# EAGLE design DoorModule_V1.0 (EAGLE 7.1.0)
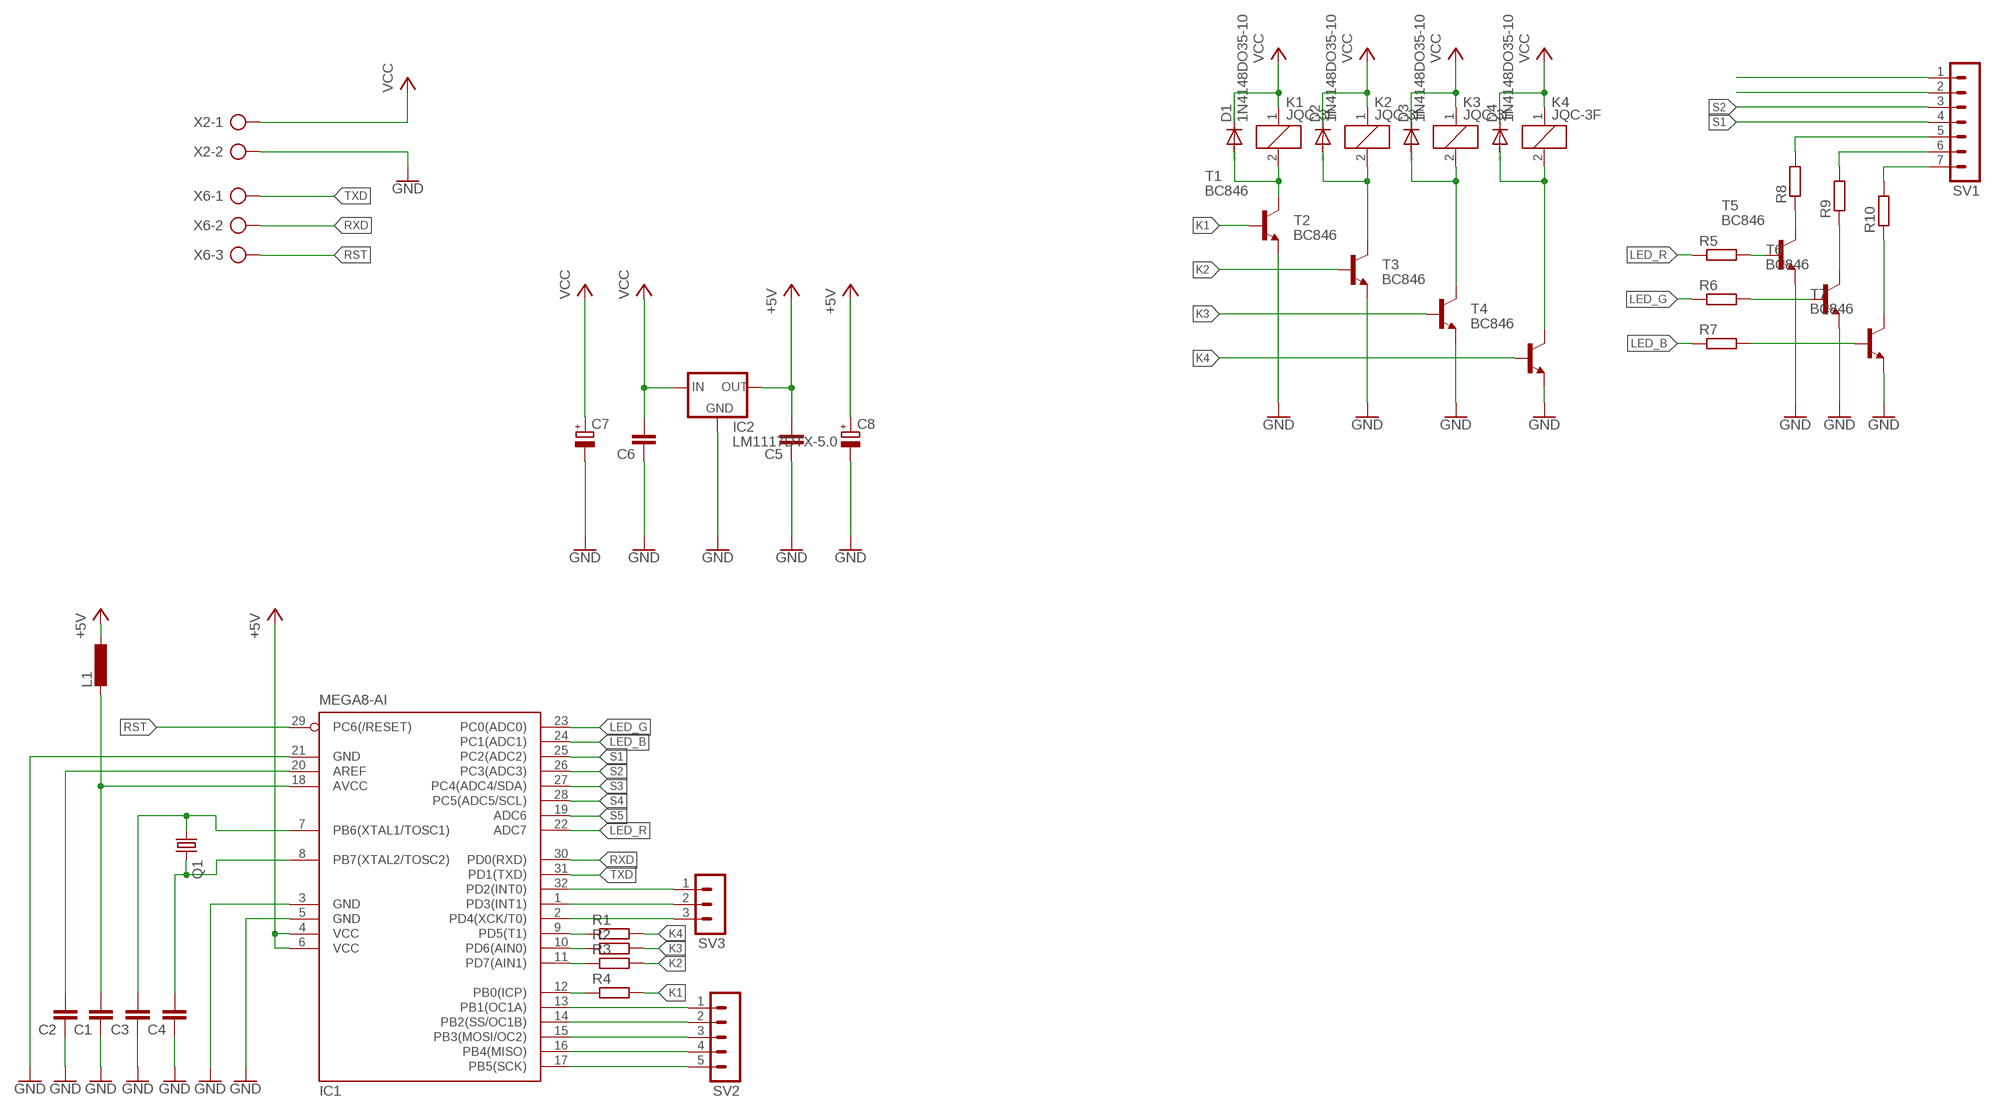
[diagram p0: schematic, sheet 1, part 1 of 2]
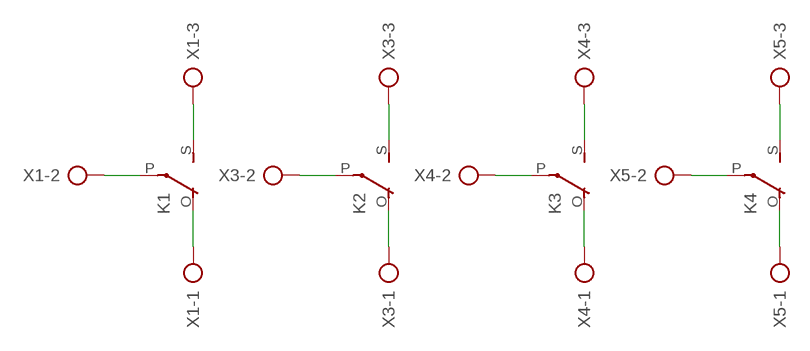
[diagram p1: schematic, sheet 1, part 2 of 2]

## Parts
C1  C-EUC0805  [C0805]
C2  C-EUC0805  [C0805]
C3  C-EUC0805  [C0805]
C4  C-EUC0805  [C0805]
C5  C-EUC0805  [C0805]
C6  C-EUC0805  [C0805]
C7  CPOL-EUE2.5-7  [E2,5-7]
C8  CPOL-EUE2.5-7  [E2,5-7]
D1  1N4148DO35-10  [DO35-10]
D2  1N4148DO35-10  [DO35-10]
D3  1N4148DO35-10  [DO35-10]
D4  1N4148DO35-10  [DO35-10]
IC1  MEGA8-AI  [TQFP32-08]
IC2  LM1117DTX-5.0  [TO252]
K1  JQC-3F  G5LE  [G5LE]
K2  JQC-3F  G5LE  [G5LE]
K3  JQC-3F  G5LE  [G5LE]
K4  JQC-3F  G5LE  [G5LE]
L1  L-EU0204/7  [0204/7]
Q1  CRYSTALHC49U-V  [HC49U-V]
R1  R-EU_0204/7  [0204/7]
R2  R-EU_0204/7  [0204/7]
R3  R-EU_0204/7  [0204/7]
R4  R-EU_0204/7  [0204/7]
R5  R-EU_R0805  [R0805]
R6  R-EU_R0805  [R0805]
R7  R-EU_R0805  [R0805]
R8  R-EU_0204/7  [0204/7]
R9  R-EU_0204/7  [0204/7]
R10  R-EU_0204/7  [0204/7]
SV1  MA07-1  [MA07-1]
SV2  MA05-1  [MA05-1]
SV3  MA03-1  [MA03-1]
T1  BC846  [SOT23]
T2  BC846  [SOT23]
T3  BC846  [SOT23]
T4  BC846  [SOT23]
T5  BC846  [SOT23]
T6  BC846  [SOT23]
T7  BC846  [SOT23]
X1  AK300/3  [AK300/3]
X2  AK300/2  [AK300/2]
X3  AK300/3  [AK300/3]
X4  AK300/3  [AK300/3]
X5  AK300/3  [AK300/3]
X6  AK300/3  [AK300/3]

## Nets
+5V: C5.2 C8.+ IC1.4(VCC) IC1.6(VCC) IC2.TAB(OUT) L1.1
GND: C1.1 C2.1 C3.1 C4.1 C5.1 C6.1 C7.- C8.- IC1.3(GND) IC1.5(GND) IC1.21(GND) IC2.1(GND) T1.2(E) T2.2(E) T3.2(E) T4.2(E) T5.2(E) T6.2(E) T7.2(E) X2.2
K1: R4.2 T1.1(B)
K2: R3.2 T2.1(B)
K3: R2.2 T3.1(B)
K4: R1.2 T4.1(B)
LED_B: IC1.24(PC1(ADC1)) R7.1
LED_G: IC1.23(PC0(ADC0)) R6.1
LED_R: IC1.22(ADC7) R5.1
N$1: K1.S(2:S) X1.3
N$2: K1.O(2:O) X1.1
N$3: K1.P(2:P) X1.2
N$4: K2.S(2:S) X3.3
N$5: C1.2 IC1.18(AVCC) L1.2
N$6: C2.2 IC1.20(AREF)
N$7: C3.2 IC1.7(PB6(XTAL1/TOSC1)) Q1.1
N$8: C4.2 IC1.8(PB7(XTAL2/TOSC2)) Q1.2
N$9: IC1.13(PB1(OC1A)) SV2.1
N$10: IC1.14(PB2(SS/OC1B)) SV2.2
N$11: D1.A K1.2 T1.3(C)
N$12: D2.A K2.2 T2.3(C)
N$13: R5.2 T5.1(B)
N$14: R6.2 T6.1(B)
N$15: R7.2 T7.1(B)
N$16: R8.1 T5.3(C)
N$17: R9.1 T6.3(C)
N$18: R10.1 T7.3(C)
N$19: R9.2 SV1.6
N$20: R10.2 SV1.7
N$21: D3.A K3.2 T3.3(C)
N$22: D4.A K4.2 T4.3(C)
N$23: IC1.9(PD5(T1)) R1.1
N$24: IC1.10(PD6(AIN0)) R2.1
N$25: IC1.11(PD7(AIN1)) R3.1
N$26: IC1.12(PB0(ICP)) R4.1
N$27: IC1.15(PB3(MOSI/OC2)) SV2.3
N$28: IC1.16(PB4(MISO)) SV2.4
N$29: IC1.32(PD2(INT0)) SV3.1
N$30: R8.2 SV1.5
N$31: K2.P(2:P) X3.2
N$32: K2.O(2:O) X3.1
N$33: K3.P(2:P) X4.2
N$34: K3.S(2:S) X4.3
N$35: K3.O(2:O) X4.1
N$36: K4.S(2:S) X5.3
N$37: K4.P(2:P) X5.2
N$38: K4.O(2:O) X5.1
N$39: IC1.17(PB5(SCK)) SV2.5
N$40: IC1.1(PD3(INT1)) SV3.2
N$41: IC1.2(PD4(XCK/T0)) SV3.3
RST: IC1.29(PC6(/RESET)) X6.3
RXD: IC1.30(PD0(RXD)) X6.2
S1: IC1.25(PC2(ADC2)) SV1.4
S2: IC1.26(PC3(ADC3)) SV1.3
S3: IC1.27(PC4(ADC4/SDA)) SV1.2
S4: IC1.28(PC5(ADC5/SCL)) SV1.1
S5: IC1.19(ADC6)
TXD: IC1.31(PD1(TXD)) X6.1
VCC: C6.2 C7.+ D1.C D2.C D3.C D4.C IC2.2(IN) K1.1 K2.1 K3.1 K4.1 X2.1

## Library data of the parts
C1-C6 = rcl:C-EU: CAPACITOR, European symbol
C7 C8 = rcl:CPOL-EU: POLARIZED CAPACITOR, European symbol
D1-D4 = diode:1N4148: DIODE high speed (Philips)
IC1 = atmel:MEGA8: MICROCONTROLLER 8 Kbytes FLASH, 1 kbytes SRAM, 512 bytes EEPROM, USART, 6-channel 10 bit ADC, 2-channel 8 bit ADC Pin compatible with Atmega48, ATMega88, ATMega168 Source: avr.lbr; MPN: ATMEGA8-16AU; OC_FARNELL: 9171371; OC_NEWARK: 73M8863
IC2 = lm1117:LM1117DTX-*
K1-K4 = relay:G5LE: RELAY 1 x switch, 10 A/120 V AC, 8 A/30 V DC, Omron; OC_FARNELL: unknown; OC_NEWARK: unknown
L1 = rcl:L-EU: INDUCTOR, European symbol
Q1 = crystal:CRYSTAL: CRYSTAL; OC_FARNELL: 1666969; OC_NEWARK: unknown
R1-R10 = rcl:R-EU_: RESISTOR, European symbol
SV1 = con-lstb:MA07-1: PIN HEADER; OC_FARNELL: unknown; OC_NEWARK: unknown
SV2 = con-lstb:MA05-1: PIN HEADER; OC_FARNELL: unknown; OC_NEWARK: unknown
SV3 = con-lstb:MA03-1: PIN HEADER; OC_FARNELL: unknown; OC_NEWARK: unknown
T1-T7 = transistor:BC846: NPN TRANSISTOR
X1 X3-X6 = con-ptr500:AK300/3: CONNECTOR; OC_FARNELL: unknown; OC_NEWARK: unknown
X2 = con-ptr500:AK300/2: CONNECTOR; OC_FARNELL: unknown; OC_NEWARK: unknown

## Board
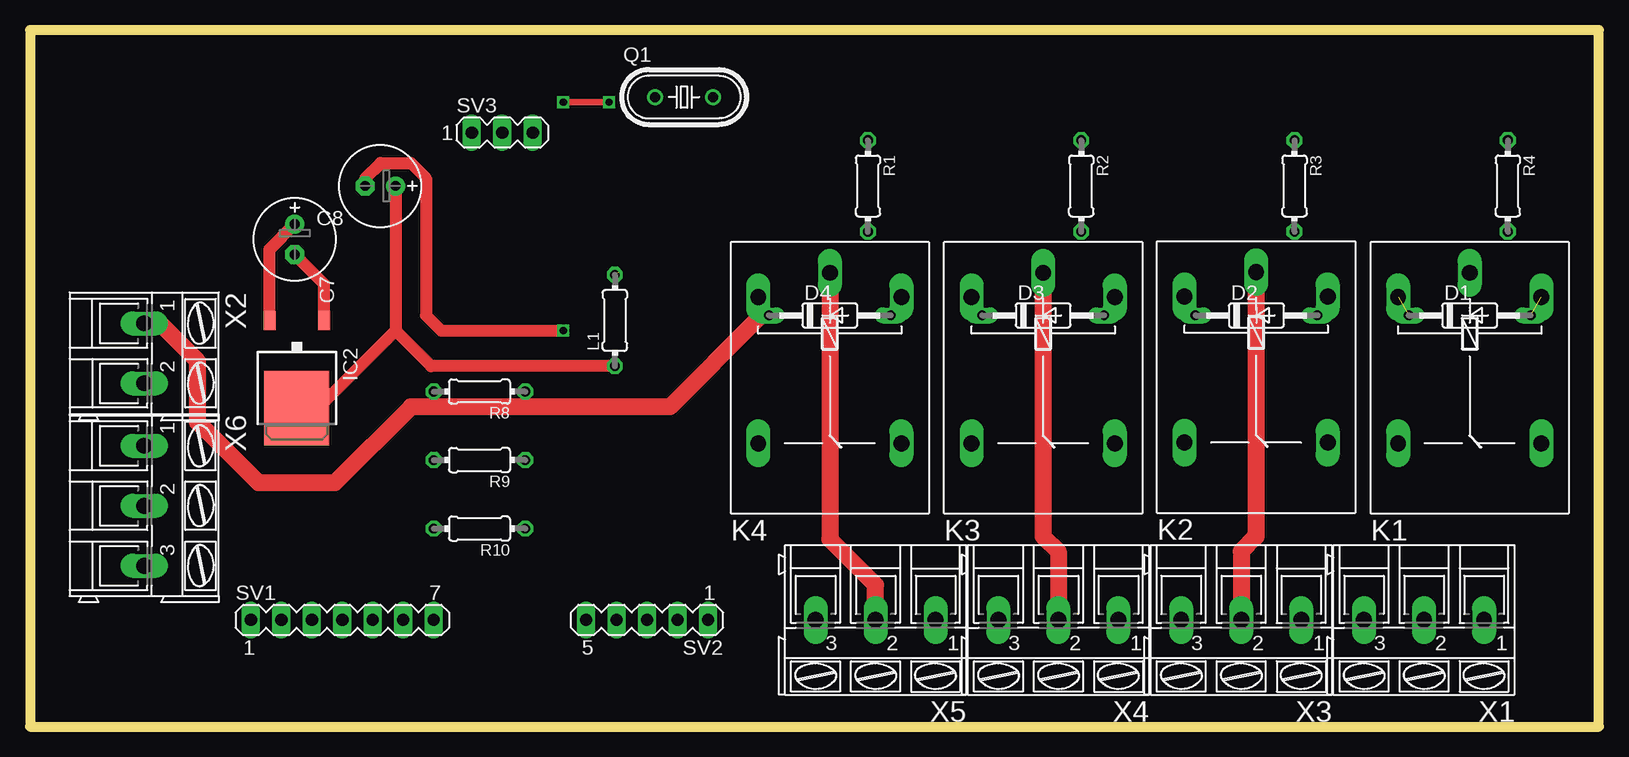
[diagram p2: board, top side]
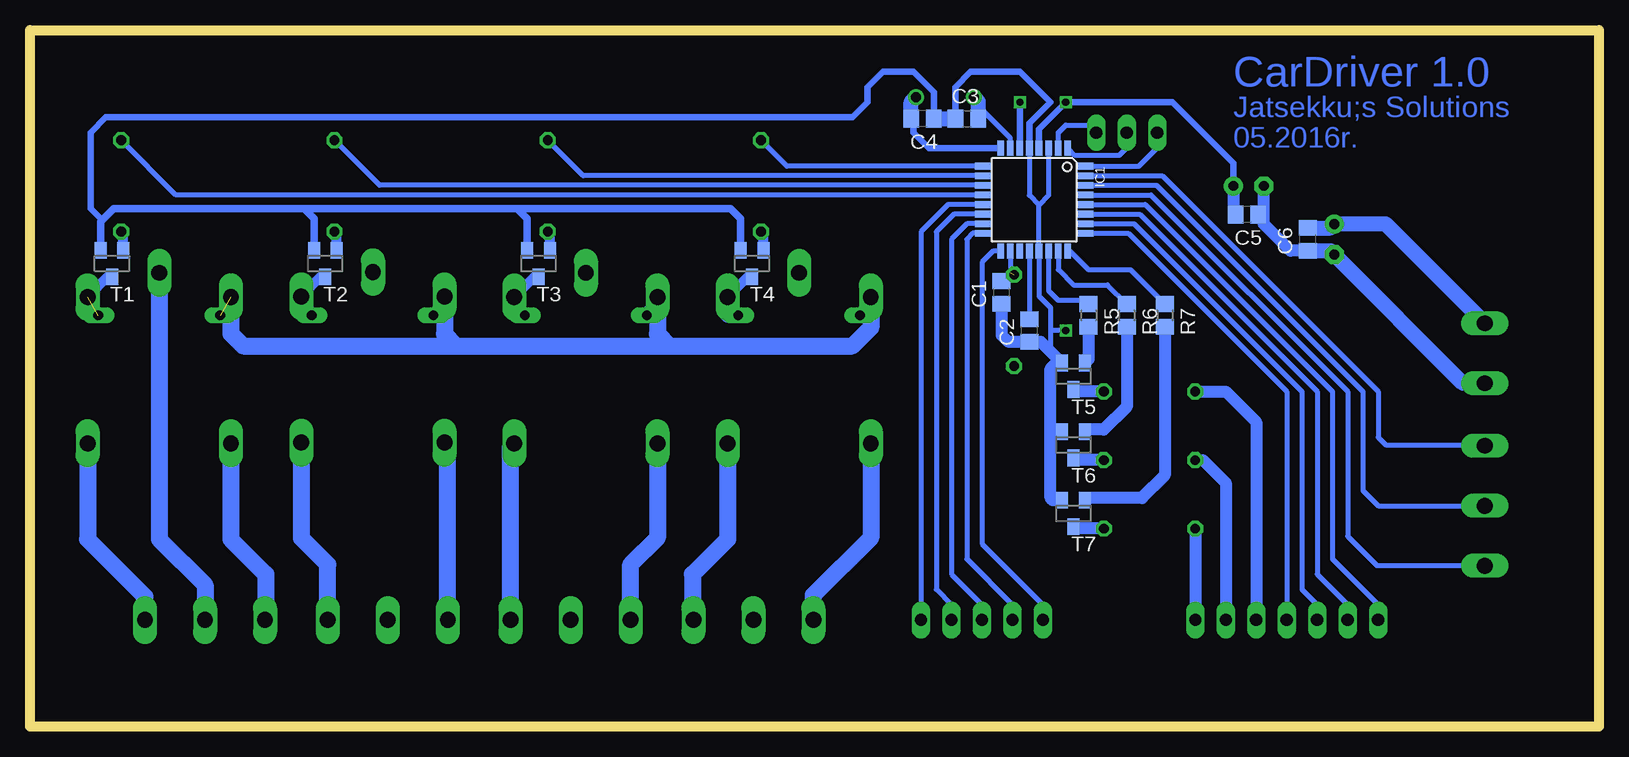
[diagram p3: board, bottom side, seen from below]

Size 130.79 x 58.09 mm. Coordinates in mm from the lower left corner, seen from the top.
Outline: 0,0 130.79,0 130.79,58.09 0,58.09 0,0
Copper layers (1*16): Top 0.035mm / dielectric 1.5mm / Bottom 0.035mm
Design rules "default": minimum track width 10mil, minimum drill 24mil, track to track 8mil, track to pad 8mil, pad to pad 8mil, via to via 8mil, smd to smd 8mil, copper to edge 40mil, drill to drill 8mil, minimum pad ring 10mil, minimum via ring 8mil, stop-mask expansion 4mil, vias tented up to drill 0mil, thermal gap 10mil

### Footprints (pad centres in the part's own frame; a part is rotated, then mirrored left to right if it is on the bottom)
C0805 = smd 1.3 x 1.5: 1 -0.95,0; 2 0.95,0
E2,5-7 = drill 0.813 pad 1.6: + -1.27,0 | drill 0.813 pad 1.6 octagon: - 1.27,0
DO35-10 = drill 0.813 long: A 5.08,0; C -5.08,0
TQFP32-08 = smd 1.27 x 0.559: 1 -4.293,2.8; 2 -4.293,2; 3 -4.293,1.2; 4 -4.293,0.4; 5 -4.293,-0.4; 6 -4.293,-1.2; 7 -4.293,-2; 8 -4.293,-2.8; 17 4.293,-2.8; 18 4.293,-2; 19 4.293,-1.2; 20 4.293,-0.4; 21 4.293,0.4; 22 4.293,1.2; 23 4.293,2; 24 4.293,2.8 | smd 0.559 x 1.27: 9 -2.8,-4.293; 10 -2,-4.293; 11 -1.2,-4.293; 12 -0.4,-4.293; 13 0.4,-4.293; 14 1.2,-4.293; 15 2,-4.293; 16 2.8,-4.293; 25 2.8,4.293; 26 2,4.293; 27 1.2,4.293; 28 0.4,4.293; 29 -0.4,4.293; 30 -1.2,4.293; 31 -2,4.293; 32 -2.8,4.293
TO252 = smd 1 x 1.6: 1 -2.28,-4.8; 2 2.28,-4.8 | smd 5.4 x 6.2: TAB 0,2.5
G5LE = drill 1.321 long: 1 -7.493,-5.969; 2 -7.493,5.969; O 4.699,5.969; P -9.525,0; S 4.699,-5.969
0204/7 = drill 0.813 octagon: 1 -3.81,0; 2 3.81,0
HC49U-V = drill 0.813: 1 -2.413,0; 2 2.413,0
R0805 = smd 1.3 x 1.5: 1 -0.95,0; 2 0.95,0
MA07-1 = drill 1.016 long: 1 -7.62,0; 2 -5.08,0; 3 -2.54,0; 4 0,0; 5 2.54,0; 6 5.08,0; 7 7.62,0
MA05-1 = drill 1.016 long: 1 -5.08,0; 2 -2.54,0; 3 0,0; 4 2.54,0; 5 5.08,0
MA03-1 = drill 1.016 long: 1 -2.54,0; 2 0,0; 3 2.54,0
SOT23 = smd 1 x 1.4: 1 -0.95,-1.1; 2 0.95,-1.1; 3 0,1.1
AK300/3 = drill 1.321 long: 1 -5.004,0; 2 0,0; 3 5.004,0
AK300/2 = drill 1.321 long: 1 -2.515,0; 2 2.489,0

### Placement (x,y rotation side)
C1  49.79,36.2 90 bottom
C2  47.48,33.03 90 bottom
C3  52.7,50.69 0 bottom
C4  56.4,50.69 180 bottom
C5  29.36,42.7 180 bottom
C6  24.27,40.63 90 bottom
C7  22.07,40.63 270 top
C8  29.2,45.08 180 top
D1  120.02,34.29 0 top
D2  102.23,34.29 0 top
D3  84.45,34.29 0 top
D4  66.67,34.29 0 top
IC1  47.08,43.94 270 bottom
IC2  22.24,29.07 180 top
K1  120.02,28.32 270 top
K2  102.2,28.38 270 top
K3  84.45,28.32 270 top
K4  66.67,28.32 270 top
L1  48.76,33.87 90 top
Q1  54.52,52.49 0 top
R1  69.85,45.09 270 top
R2  87.63,45.09 270 top
R3  105.41,45.09 270 top
R4  123.19,45.09 270 top
R5  42.55,34.29 270 bottom
R6  39.37,34.29 270 bottom
R7  36.2,34.29 270 bottom
R8  37.47,27.94 180 top
R9  37.47,22.23 180 top
R10  37.47,16.51 180 top
SV1  26.04,8.89 0 top
SV2  51.44,8.89 180 top
SV3  39.37,49.53 0 top
T1  123.95,38.61 180 bottom
T2  106.17,38.61 180 bottom
T3  88.39,38.61 180 bottom
T4  70.61,38.61 180 bottom
T5  43.81,29.21 180 bottom
T6  43.81,23.5 180 bottom
T7  43.81,17.78 180 bottom
X1  116.2,8.89 180 top
X2  9.53,31.11 270 top
X3  100.97,8.89 180 top
X4  85.72,8.89 180 top
X5  70.48,8.89 180 top
X6  9.53,18.41 270 top

### Tracks (layer width: path | path; a pad name or v marks a point on that pad's centre or on a via)
+5V  (via drill 0.6)
  Top 0.533: v48.26,52.07 v44.45,52.07
  Top 1.016: C8.+ 30.47,33.01 | 30.47,33.01 22.86,25.4 22.86,25.95 IC2.TAB | L1.1 33.42,30.06 30.47,33.01
  Bottom 0.533: IC1.6 48.26,48.25 v48.26,52.07 | IC1.4 46.68,49.84 v44.45,52.07 35.56,52.07 30.47,46.98 C8.+
  Bottom 1.016: C8.+ 30.47,42.86 C5.2
GND  (via drill 0.6)
  Top 1.016: IC2.1 24.52,36.91 C7.- | v27.94,45.09 27.94,45.72 29.21,46.99 31.75,46.99 33.02,45.72 33.02,34.29 34.29,33.02 v44.45,33.02
  Bottom 0.406: 45.09,30.63 T5.2 45.72,31.27 45.72,33.02 | 45.72,33.02 45.72,34.92 46.68,35.88 IC1.21 46.68,43.51 | 46.68,43.51 47.48,44.3 IC1.5 | IC1.3 45.88,44.3 46.68,43.51 | v44.45,33.02 45.72,33.02
  Bottom 0.533: C3.1 53.65,53.34 52.38,54.61 48.26,54.61 45.72,52.07 47.48,50.31 IC1.5 | C4.1 55.45,52.91 57.15,54.61 59.69,54.61 60.96,53.34 60.96,52.07 62.23,50.8 124.46,50.8 125.73,49.53 125.73,43.18 124.78,42.23 | 27.94,43.18 v27.94,45.09
  Bottom 0.61: T4.2 71.56,42.35 72.39,43.18 90.17,43.18 | T3.2 89.34,42.35 90.17,43.18 | T2.2 107.12,42.35 107.95,43.18 | 90.17,43.18 107.95,43.18 | 107.95,43.18 123.83,43.18 124.78,42.23 124.9,42.1 T1.2 | 45.09,30.48 44.94,30.48 T5.2 | 45.55,24.59 45.72,24.77
  Bottom 1.016: T7.2 45.55,18.88 45.72,19.05 45.72,24.77 45.72,29.84 45.09,30.48 | T6.2 45.55,24.59 | T5.2 46.53,32.08 C2.1 49.22,32.08 49.79,32.65 C1.1 | C6.1 25.71,39.68 27.94,41.91 27.94,43.18 | 27.94,43.18 C8.- | C5.1 28.41,42.72 27.94,43.18
  Bottom 1.27: C4.1 C3.1 | X2.2 11.34,28.63 C7.- 22.39,39.68 C6.1
K1
  Bottom 0.813: T1.1 123,41.09 R4.2
K2
  Bottom 0.813: T2.1 105.22,41.09 R3.2
K3
  Bottom 0.813: T3.1 87.44,41.09 R2.2
K4
  Bottom 0.813: T4.1 69.66,41.09 R1.2
LED_B
  Bottom 0.406: 36.51,35.24 R7.1 39.05,38.1 42.55,38.1 44.09,39.64 IC1.24
LED_G
  Bottom 0.406: IC1.23 45.08,38.09 43.81,36.83 40.96,36.83 R6.1
LED_R
  Bottom 0.406: 42.86,34.92 R5.1 42.87,35.56 45.09,35.56 45.88,36.35 IC1.22
N$1
  Bottom 1.422: K1.S 114.05,15.62 111.12,12.7 111.12,8.97 X1.3
N$2
  Bottom 1.422: K1.O 125.98,15.62 121.21,10.85 X1.1
N$3
  Bottom 1.422: K1.P 120.02,15.62 116.2,11.81 X1.2
N$4
  Bottom 1.422: X3.3 95.96,23.41 K2.S
N$5  (1 unrouted)
  Bottom 0.406: IC1.18 49.08,37.86 C1.2
N$6
  Bottom 0.406: IC1.20 C2.2
N$7
  Bottom 0.406: 51.69,50.16 51.69,50.63 C3.2 | IC1.7 49.08,49.08 51.44,51.44 51.75,51.44
  Bottom 0.533: 51.68,52.07 51.75,52.14
  Bottom 1.27: C3.2 51.75,51.44 51.75,52.14 Q1.1
N$8
  Bottom 0.533: IC1.8 55.85,48.23 57.15,49.53 57.15,50.49 C4.2
  Bottom 1.27: C4.2 57.34,52.08 Q1.2
N$9
  Bottom 0.406: IC1.13 54.26,43.53 56.52,41.27 SV2.1
N$10
  Bottom 0.406: IC1.14 53.78,42.73 55.24,41.27 55.24,11.43 53.98,10.16 SV2.2
N$11  (1 unrouted)
  Bottom 0.813: T1.3 124.29,37.51 K1.2
N$12
  Bottom 0.813: T2.3 106.54,37.51 K2.2
  Bottom 1.27: K2.2 108.17,35.15 D2.A
N$13
  Bottom 1.016: R5.2 42.55,30.63 T5.1
N$14
  Bottom 0.61: 42.7,24.77 T6.1
  Bottom 1.016: R6.2 39.37,26.67 41.27,24.77 42.7,24.77
N$15
  Bottom 1.016: R7.2 36.2,20.95 38.1,19.05 42.7,19.05 T7.1
N$16
  Bottom 0.61: 43.65,27.94 T5.3
  Bottom 1.016: R8.1 43.65,27.94
N$17
  Bottom 0.61: 43.65,22.23 T6.3
  Bottom 1.016: R9.1 43.65,22.23
N$18
  Bottom 0.61: 43.65,16.51 T7.3
  Bottom 1.016: R10.1 43.65,16.51
N$19
  Bottom 1.016: R9.2 33.02,22.23 31.11,20.32 SV1.6
N$20
  Bottom 1.016: R10.2 SV1.7
N$21
  Bottom 0.813: T3.3 88.73,37.51 K3.2
  Bottom 1.27: K3.2 90.42,34.54 90.17,34.29 D3.A
N$22
  Bottom 0.813: T4.3 70.95,37.51 K4.2
  Bottom 1.27: D4.A 72.64,34.29 K4.2
N$23
  Bottom 0.406: IC1.9 67.69,46.73 R1.1
N$24
  Bottom 0.406: IC1.10 84.67,45.94 R2.1
N$25
  Bottom 0.406: IC1.11 101.65,45.13 R3.1
N$26
  Bottom 0.406: IC1.12 118.63,44.34 R4.1
N$27
  Bottom 0.406: IC1.15 52.68,41.94 53.98,40.64 53.98,12.7 51.44,10.16 SV2.3
N$28
  Bottom 0.406: IC1.16 52.21,41.13 52.7,40.64 52.7,13.97 48.9,10.16 SV2.4
N$29
  Bottom 0.406: IC1.32 38.35,46.73 36.83,48.26 SV3.1
N$30
  Bottom 1.016: R8.2 31.11,27.94 28.57,25.4 SV1.5
N$31
  Top 1.422: K2.P 102.2,15.85 100.97,14.61 X3.2
N$32
  Bottom 1.422: K2.O 108.17,15.72 105.97,13.51 X3.1
N$33
  Top 1.422: K3.P 84.45,15.88 85.72,14.61 X4.2
N$34
  Bottom 1.422: K3.S 78.49,15.75 80.72,13.51 X4.3
N$35
  Bottom 1.422: X4.1 90.73,23.32 K3.O
N$36
  Bottom 1.422: K4.S 60.71,15.75 65.48,10.97 X5.3
N$37
  Top 1.422: K4.P 66.67,15.62 70.48,11.81 X5.2
N$38
  Bottom 1.422: K4.O 72.64,15.62 75.56,12.7 75.56,8.97 X5.1
N$39
  Bottom 0.406: IC1.17 50.53,39.64 51.44,38.73 51.44,15.24 46.35,10.16 SV2.5
N$40
  Bottom 0.406: SV3.2 39.37,48.26 40.01,47.62 43.68,47.62 IC1.1
N$41
  Bottom 0.406: IC1.2 45.08,49.53 44.45,50.16 42.55,50.16 SV3.3
RST
  Bottom 0.406: IC1.29 37.35,44.34 20.95,27.94 20.95,15.88 18.49,13.41 X6.3
RXD
  Bottom 0.406: IC1.30 36.88,45.13 19.68,27.94 19.68,19.68 18.41,18.41 X6.2
S1
  Bottom 0.406: IC1.25 39.23,41.13 26.04,27.94 SV1.4
S2
  Bottom 0.406: IC1.26 38.76,41.94 24.77,27.94 24.77,11.43 23.5,10.16 SV1.3
S3
  Bottom 0.406: IC1.27 38.29,42.73 23.5,27.94 23.5,12.7 20.95,10.16 SV1.2
S4
  Bottom 0.406: IC1.28 37.82,43.53 22.23,27.94 22.23,13.97 18.41,10.16 SV1.1
TXD
  Bottom 0.406: IC1.31 36.41,45.94 18.41,27.94 18.41,24.13 17.78,23.5 9.6,23.5 X6.1
VCC  (1 unrouted)
  Top 1.016: IC2.2 19.96,39.79 C7.+
  Top 1.422: K4.1 60.71,34.04 53.34,26.67 31.75,26.67 25.4,20.32 19.05,20.32 13.97,25.4 13.97,30.48 10.79,33.66 9.55,33.66 X2.1
  Bottom 1.27: X2.1 9.53,33.66 17.78,41.91 C7.+ 22.39,41.58 C6.2 | D4.C 60.71,34.29 K4.1 | K3.1 78.49,35.18 D3.C | D2.C 96.52,34.29 96.52,35.59 K2.1
  Bottom 1.422: K1.1 114.05,32.77 113.03,31.75 95.25,31.75 | K2.1 96.24,32.74 95.25,31.75 | K3.1 78.49,32.77 77.47,31.75 | 95.25,31.75 77.47,31.75 | 77.47,31.75 62.23,31.75 60.71,33.27 K4.1

### Text on the board
Bottom: CarDriver 1.0 | Jatsekku;s Solutions | 05.2016r.